# Altium schematic sheet JTAG.SchDoc
size A4; SheetNumber: 1; SheetTotal: 1
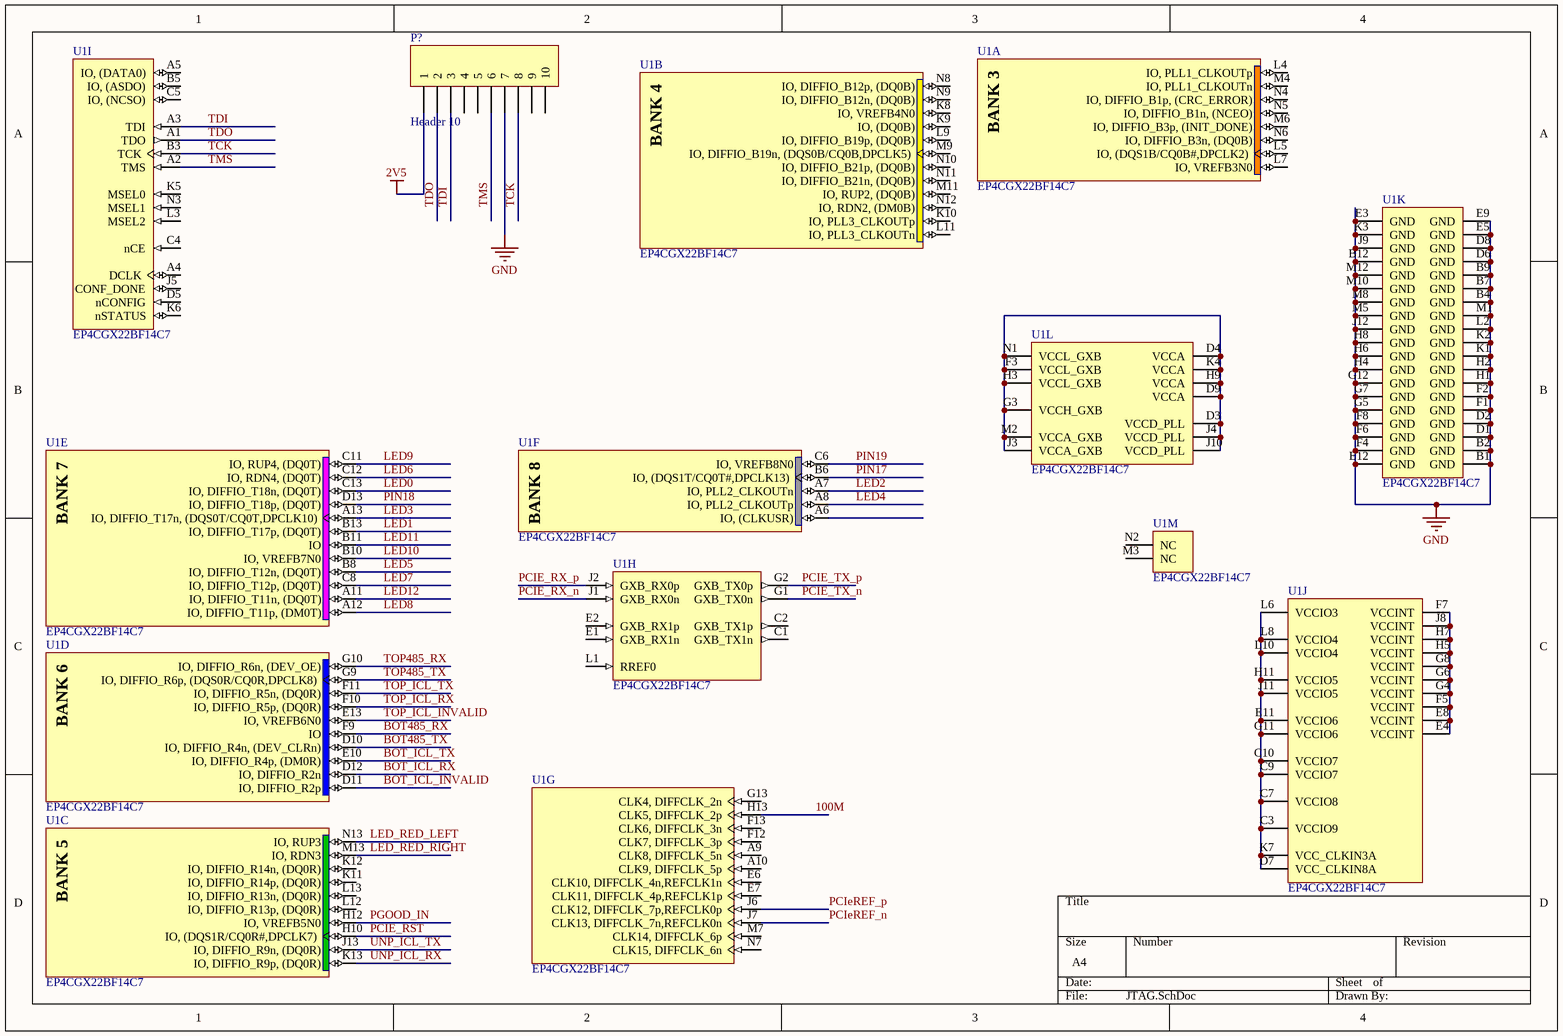
[diagram p0: JTAG.SchDoc]

## Parts
P?  Header 10  [HDR1X10]
U1  EP4CGX22BF14C7  [FBGA169]  (parts A,B,C,D,E,F,G,H,I,J,K,L,M of 13)

## Nets
2V5: P?.1
GND: P?.7 U1.B1(GND) U1.B2(GND) U1.B4(GND) U1.B7(GND) U1.B9(GND) U1.B12(GND) U1.D1(GND) U1.D2(GND) U1.D6(GND) U1.D8(GND) U1.E3(GND) U1.E5(GND) U1.E9(GND) U1.E12(GND) U1.F1(GND) U1.F2(GND) U1.F4(GND) U1.F6(GND) U1.F8(GND) U1.G5(GND) U1.G7(GND) U1.G12(GND) U1.H1(GND) U1.H2(GND) U1.H4(GND) U1.H6(GND) U1.H8(GND) U1.J9(GND) U1.J12(GND) U1.K1(GND) U1.K2(GND) U1.K3(GND) U1.L2(GND) U1.M1(GND) U1.M5(GND) U1.M8(GND) U1.M10(GND) U1.M12(GND)
100M: U1.H13(CLK5,_DIFFCLK_2p)
BOT485_RX: U1.F9(IO)
BOT485_TX: U1.D10(IO,_DIFFIO_R4n,_(DEV_CLRn))
BOT_ICL_INVALID: U1.D11(IO,_DIFFIO_R2p)
BOT_ICL_RX: U1.D12(IO,_DIFFIO_R2n)
BOT_ICL_TX: U1.E10(IO,_DIFFIO_R4p,_(DM0R))
LED0: U1.C13(IO,_DIFFIO_T18n,_(DQ0T))
LED1: U1.B13(IO,_DIFFIO_T17p,_(DQ0T))
LED2: U1.A7(IO,_PLL2_CLKOUTn)
LED3: U1.A13(IO,_DIFFIO_T17n,_(DQS0T/CQ0T,DPCLK10))
LED4: U1.A8(IO,_PLL2_CLKOUTp)
LED5: U1.B8(IO,_DIFFIO_T12n,_(DQ0T))
LED6: U1.C12(IO,_RDN4,_(DQ0T))
LED7: U1.C8(IO,_DIFFIO_T12p,_(DQ0T))
LED8: U1.A12(IO,_DIFFIO_T11p,_(DM0T))
LED9: U1.C11(IO,_RUP4,_(DQ0T))
LED10: U1.B10(IO,_VREFB7N0)
LED11: U1.B11(IO)
LED12: U1.A11(IO,_DIFFIO_T11n,_(DQ0T))
LED_RED_LEFT: U1.N13(IO,_RUP3)
LED_RED_RIGHT: U1.M13(IO,_RDN3)
PCIE_RST: U1.H10(IO,_(DQS1R/CQ0R#,DPCLK7))
PCIE_RX_n: U1.J1(GXB_RX0n)
PCIE_RX_p: U1.J2(GXB_RX0p)
PCIE_TX_n: U1.G1(GXB_TX0n)
PCIE_TX_p: U1.G2(GXB_TX0p)
PCIeREF_n: U1.J7(CLK13,_DIFFCLK_7n,REFCLK0n)
PCIeREF_p: U1.J6(CLK12,_DIFFCLK_7p,REFCLK0p)
PGOOD_IN: U1.H12(IO,_VREFB5N0)
PIN17: U1.B6(IO,_(DQS1T/CQ0T#,DPCLK13))
PIN18: U1.D13(IO,_DIFFIO_T18p,_(DQ0T))
PIN19: U1.C6(IO,_VREFB8N0)
TCK: P?.8 U1.B3(TCK)
TDI: P?.3 U1.A3(TDI)
TDO: P?.2 U1.A1(TDO)
TMS: P?.6 U1.A2(TMS)
TOP485_RX: U1.G10(IO,_DIFFIO_R6n,_(DEV_OE))
TOP485_TX: U1.G9(IO,_DIFFIO_R6p,_(DQS0R/CQ0R,DPCLK8))
TOP_ICL_INVALID: U1.E13(IO,_VREFB6N0)
TOP_ICL_RX: U1.F10(IO,_DIFFIO_R5p,_(DQ0R))
TOP_ICL_TX: U1.F11(IO,_DIFFIO_R5n,_(DQ0R))
UNP_ICL_RX: U1.K13(IO,_DIFFIO_R9p,_(DQ0R))
UNP_ICL_TX: U1.J13(IO,_DIFFIO_R9n,_(DQ0R))
NetU1_C3: U1.C3(VCCIO9) U1.C7(VCCIO8) U1.C9(VCCIO7) U1.C10(VCCIO7) U1.D7(VCC_CLKIN8A) U1.E11(VCCIO6) U1.G11(VCCIO6) U1.H11(VCCIO5) U1.J11(VCCIO5) U1.K7(VCC_CLKIN3A) U1.L6(VCCIO3) U1.L8(VCCIO4) U1.L10(VCCIO4)
NetU1_D3: U1.D3(VCCD_PLL) U1.D4(VCCA) U1.D9(VCCA) U1.F3(VCCL_GXB) U1.G3(VCCH_GXB) U1.H3(VCCL_GXB) U1.H9(VCCA) U1.J3(VCCA_GXB) U1.J4(VCCD_PLL) U1.J10(VCCD_PLL) U1.K4(VCCA) U1.M2(VCCA_GXB) U1.N1(VCCL_GXB)
NetU1_E4: U1.E4(VCCINT) U1.E8(VCCINT) U1.F5(VCCINT) U1.F7(VCCINT) U1.G4(VCCINT) U1.G6(VCCINT) U1.G8(VCCINT) U1.H5(VCCINT) U1.H7(VCCINT) U1.J8(VCCINT)

Not connected (* = marked no-connect by the designer): P? 4 5 9 10; U1 A4(DCLK) A5(IO,_(DATA0)) A6(IO,_(CLKUSR)) A9(CLK8,_DIFFCLK_5n) A10(CLK9,_DIFFCLK_5p) B5(IO,_(ASDO)) C1(GXB_TX1n) C2(GXB_TX1p) C4(nCE) C5(IO,_(NCSO)) D5(nCONFIG) E1(GXB_RX1n) E2(GXB_RX1p) E6(CLK10,_DIFFCLK_4n,REFCLK1n) E7(CLK11,_DIFFCLK_4p,REFCLK1p) F12(CLK7,_DIFFCLK_3p) F13(CLK6,_DIFFCLK_3n) G13(CLK4,_DIFFCLK_2n) J5(CONF_DONE) K5(MSEL0) K6(nSTATUS) K8(IO,_VREFB4N0) K9(IO,_(DQ0B)) K10(IO,_PLL3_CLKOUTp) K11(IO,_DIFFIO_R14p,_(DQ0R)) K12(IO,_DIFFIO_R14n,_(DQ0R)) L1(RREF0) L3(MSEL2) L4(IO,_PLL1_CLKOUTp) L5(IO,_(DQS1B/CQ0B#,DPCLK2)) L7(IO,_VREFB3N0) L9(IO,_DIFFIO_B19p,_(DQ0B)) L11(IO,_PLL3_CLKOUTn) L12(IO,_DIFFIO_R13p,_(DQ0R)) L13(IO,_DIFFIO_R13n,_(DQ0R)) M3(NC) M4(IO,_PLL1_CLKOUTn) M6(IO,_DIFFIO_B3p,_(INIT_DONE)) M7(CLK14,_DIFFCLK_6p) M9(IO,_DIFFIO_B19n,_(DQS0B/CQ0B,DPCLK5)) M11(IO,_RUP2,_(DQ0B)) N2(NC) N3(MSEL1) N4(IO,_DIFFIO_B1p,_(CRC_ERROR)) N5(IO,_DIFFIO_B1n,_(NCEO)) N6(IO,_DIFFIO_B3n,_(DQ0B)) N7(CLK15,_DIFFCLK_6n) N8(IO,_DIFFIO_B12p,_(DQ0B)) N9(IO,_DIFFIO_B12n,_(DQ0B)) N10(IO,_DIFFIO_B21p,_(DQ0B)) N11(IO,_DIFFIO_B21n,_(DQ0B)) N12(IO,_RDN2,_(DM0B))

## Notes on the sheet
- (in symbol EP4CGX22BF14C7, part A) BANK 3
- (in symbol EP4CGX22BF14C7, part B) BANK 4
- (in symbol EP4CGX22BF14C7, part C) BANK 5
- (in symbol EP4CGX22BF14C7, part D) BANK 6
- (in symbol EP4CGX22BF14C7, part E) BANK 7
- (in symbol EP4CGX22BF14C7, part F) BANK 8

## Library data of the parts
P? = Header 10: Header, 10-Pin; LatestRevisionDate: 17-Jul-2002; LatestRevisionNote: Re-released for DXP Platform.; Publisher: Altium Limited
U1 = EP4CGX22BF14C7: Cyclone IV Family FPGA, 2V Core, 72 I/O Pins, 4 PLLs, 2 High-Speed Transceivers, 169-Pin FBGA, Speed Grade 7, Commercial Grade; DatasheetVersion: ver1.2, Mar-2010; PackageVersion: ver16.0, Dec-2009; PackageReference: FBGA169; PackageDescription: 169-Ball FineLine Ball Grid Array (FBGA169) - Wire Bond; ComponentLink1Description: Manufacturer URL; ComponentLink1URL: http://www.altera.com/; ComponentLink2Description: Handbook; ComponentLink2URL: http://www.altera.com/literature/hb/cyclone-iv/cyclone4-handbook.pdf; ComponentLink3Description: Pinout; ComponentLink3URL: http://www.altera.com/literature/lit-dp.jsp?category=cyc%204&showspreadsheet=y; ComponentLink4Description: Package Specification; ComponentLink4URL: http://www.altera.com/literature/ds/dspkg.pdf